# EAGLE schematic main (EAGLE 8.5.0)
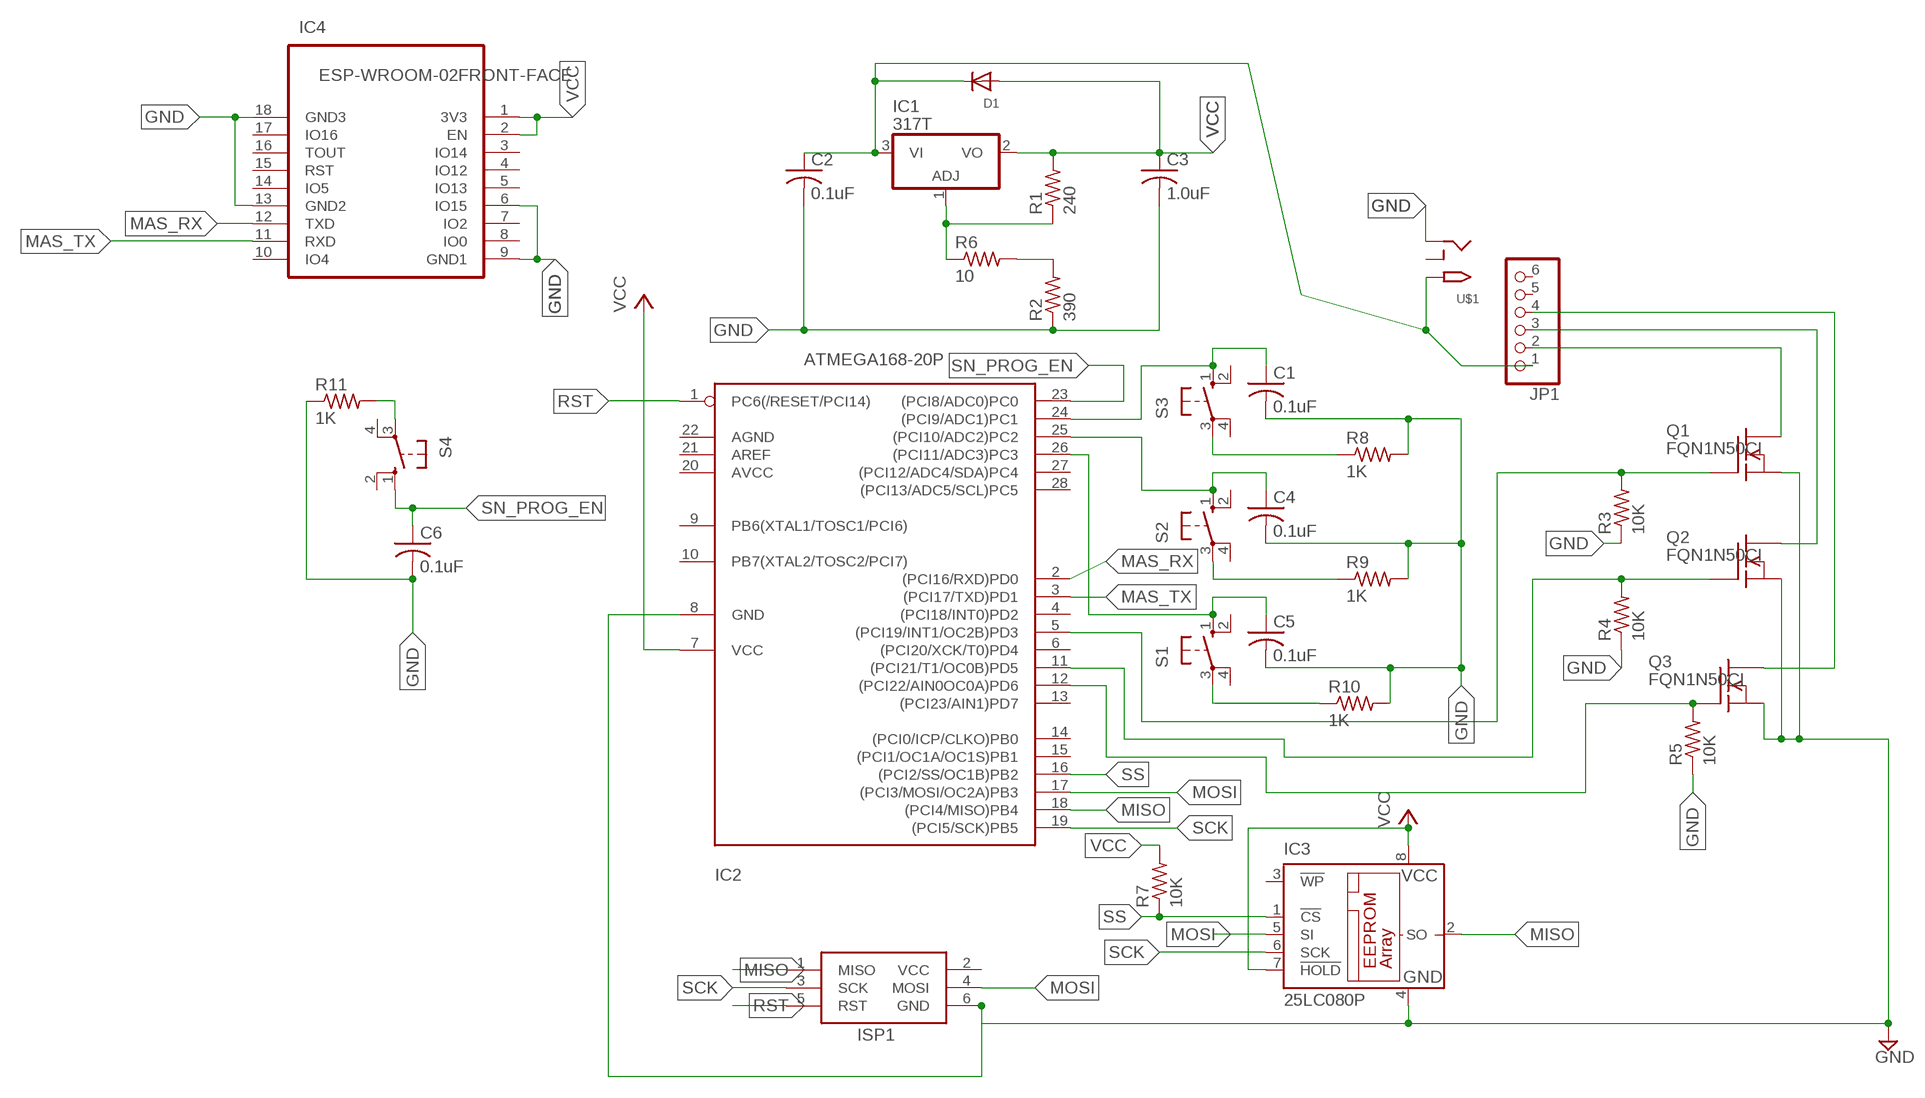
[diagram p0: schematic, sheet 1]

## Parts
C1  0.1uF  C-US025-030X050  [C025-030X050]
C2  0.1uF  C-US025-030X050  [C025-030X050]
C3  1.0uF  C-US025-030X050  [C025-030X050]
C4  0.1uF  C-US025-030X050  [C025-030X050]
C5  0.1uF  C-US025-030X050  [C025-030X050]
C6  0.1uF  C-US025-030X050  [C025-030X050]
D1  DIODEDO-1N4148  [DO-1N4148]
IC1  317T  [TO220H]
IC2  ATMEGA168-20P  [DIL28-3]
IC3  25LC080P  [DIL8]
IC4  ESP-WROOM-02FRONT-FACE  [FRONT-FACE]
ISP1  AVRISP-6  [AVRISP]
JP1  PINHD-1X6B  [1X06-BIG]
Q1  FQN1N50CI  [TO92-INLINE]
Q2  FQN1N50CI  [TO92-INLINE]
Q3  FQN1N50CI  [TO92-INLINE]
R1  240  R-US_0204/7  [0204/7]
R2  390  R-US_0204/7  [0204/7]
R3  10K  R-US_0204/7  [0204/7]
R4  10K  R-US_0204/7  [0204/7]
R5  10K  R-US_0204/7  [0204/7]
R6  10  R-US_0204/7  [0204/7]
R7  10K  R-US_0204/7  [0204/7]
R8  1K  R-US_0204/7  [0204/7]
R9  1K  R-US_0204/7  [0204/7]
R10  1K  R-US_0204/7  [0204/7]
R11  1K  R-US_0204/7  [0204/7]
S1  10-XX  [B3F-10XX]
S2  10-XX  [B3F-10XX]
S3  10-XX  [B3F-10XX]
S4  10-XX  [B3F-10XX]
U$1  2.1MMJACKTHM  [PJ-102A]

## Nets
GND: C1.2 C2.2 C3.2 C4.2 C5.2 C6.2 IC2.8(GND) IC3.4(GND) IC4.6(IO15) IC4.9(GND1) IC4.13(GND2) IC4.18(GND3) ISP1.6(GND) Q1.3(S) Q2.3(S) Q3.3(S) R2.1 R3.1 R4.1 R5.1 R8.2 R9.2 R10.2 R11.1 U$1.RING
MAS_RX: IC2.2((PCI16/RXD)PD0) IC4.12(TXD)
MAS_TX: IC2.3((PCI17/TXD)PD1) IC4.11(RXD)
MISO: IC2.18((PCI4/MISO)PB4) IC3.2(SO) ISP1.1(MISO)
MOSI: IC2.17((PCI3/MOSI/OC2A)PB3) IC3.5(SI) ISP1.4(MOSI)
N$1: C1.1 IC2.24((PCI9/ADC1)PC1) S3.1(S)
N$2: C4.1 IC2.25((PCI10/ADC2)PC2) S2.1(S)
N$3: C5.1 IC2.26((PCI11/ADC3)PC3) S1.1(S)
N$4: R2.2 R6.2
N$5: IC2.12((PCI22/AIN0OC0A)PD6) Q3.2(G) R5.2
N$6: IC1.1(ADJ) R1.1 R6.1
N$7: R8.1 S3.3(P)
N$8: JP1.2 Q1.1(D)
N$9: R9.1 S2.3(P)
N$10: R10.1 S1.3(P)
N$11: JP1.3 Q2.1(D)
N$13: JP1.4 Q3.1(D)
N$14: R11.2 S4.3(P)
N$15: IC2.5((PCI19/INT1/OC2B)PD3) Q1.2(G) R3.2
N$16: IC2.11((PCI21/T1/OC0B)PD5) Q2.2(G) R4.2
RST: IC2.1(PC6(/RESET/PCI14)) ISP1.5(RST)
SCK: IC2.19((PCI5/SCK)PB5) IC3.6(SCK) ISP1.3(SCK)
SN_PROG_EN: C6.1 IC2.23((PCI8/ADC0)PC0) S4.1(S)
SS: IC2.16((PCI2/SS/OC1B)PB2) IC3.1(!CS) R7.1
VCC: C3.1 D1.A IC1.2(VO) IC2.7(VCC) IC3.7(!HOLD) IC3.8(VCC) IC4.1(3V3) IC4.2(EN) R1.2 R7.2
VIN: C2.1 D1.C IC1.3(VI) JP1.1 U$1.TIP
Unconnected: IC2.4((PCI18/INT0)PD2) IC2.6((PCI20/XCK/T0)PD4) IC2.9(PB6(XTAL1/TOSC1/PCI6)) IC2.10(PB7(XTAL2/TOSC2/PCI7)) IC2.13((PCI23/AIN1)PD7) IC2.14((PCI0/ICP/CLKO)PB0) IC2.15((PCI1/OC1A/OC1S)PB1) IC2.20(AVCC) IC2.21(AREF) IC2.22(AGND) IC2.27((PCI12/ADC4/SDA)PC4) IC2.28((PCI13/ADC5/SCL)PC5) IC3.3(!WP) IC4.3(IO14) IC4.4(IO12) IC4.5(IO13) IC4.7(IO2) IC4.8(IO0) IC4.10(IO4) IC4.14(IO5) IC4.15(RST) IC4.16(TOUT) IC4.17(IO16) JP1.5 JP1.6 S1.2(S1) S1.4(P1) S2.2(S1) S2.4(P1) S3.2(S1) S3.4(P1) S4.2(S1) S4.4(P1) U$1.RING_SW

## Power pins joined to a net without a drawn wire
VCC: ISP1.2(VCC)

## Library data of the parts
C1-C6 = adafruit:C-US: CAPACITOR, American symbol
D1 = adafruit:DIODE: Diode SMADIODE - SMA Surface Mount Package 20V 1A Schottky Diode Digikey: 641-1014-6-ND DO-1N4148 - Through Hole Small Current Diode SOD-123 20V 1 A (.5mV Vf) Schottky Diode - Digikey: MBRX120TPMSCT-ND SOD-323 10V 570mA (.38mV Vf, 3ns) Schottky Diode - Digikey: ZLLS410CT-ND SOD-523 30V 30mA Schottky Diode (RB751S-40TE61) - Digikey: RB751S-40TE61CT-ND SOT23-R/W - SOT23 Package (R = Solder Paste/Reflow Ovens, W = Hand-Soldering) BAT54Film 40V 300mA - Digikey: 497-7162-1-ND
IC1 = linear:*317: Positive VOLTAGE REGULATOR
IC2 = adafruit:ATMEGA168*P: MICROCONTROLLER 16 kBytes FLASH 1 kBytes SRAM 512 Bytes EEPROM USART 8-channel 10 bit ADC
IC3 = microchip:25*: Serial EEPROM 4K/ 8K , SPI bus; MF: MICROCHIP; MPN: 25LC080/P; OC_FARNELL: 1556143; OC_NEWARK: 92C7440
IC4 = esp-wroom-02:ESP-WROOM-02: WiFi module - ESP-WROOM-02
ISP1 = adafruit:AVRISP: AVR ISP HEADER Standard 6 pin header for AVR programming
JP1 = adafruit:PINHD-1X6: PIN HEADER
Q1-Q3 = adafruit:FQN1N50C: N-Channel Enhancement MOSFET 500V, 0.4A, 6.0 Ohm
R1-R11 = adafruit:R-US_: RESISTOR, American symbol
S1-S4 = switch-omron:10-XX: OMRON SWITCH; MPN: B3F-1000; OC_FARNELL: 176432; OC_NEWARK: 36M3542
U$1 = adafruit:2.1MMJACK: 2.1mm x 5.5mm THM DC jack with internal switch. Digikey part #PJ-102A, 4UCON part #05537 2.1mm x 5.5mm SMT DC jack with internal switch. Digikey part #PJ-002A-SMT, 4UCON part #03267 By microbuilder.eu & adafruit.com